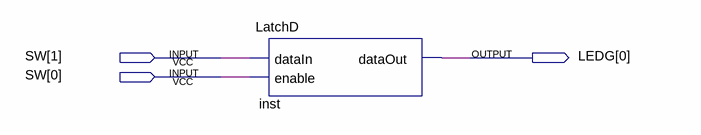
[diagram p0: schematic sheet]
// Quartus schematic LatchD_Demo.bdf as structural Verilog: 1 symbols, 3 pins
module LatchD_Demo (
  input  [1:0] SW,
  output [0:0] LEDG
);

  LatchD inst (.dataIn(SW[1]), .enable(SW[0]), .dataOut(LEDG[0]));
endmodule
